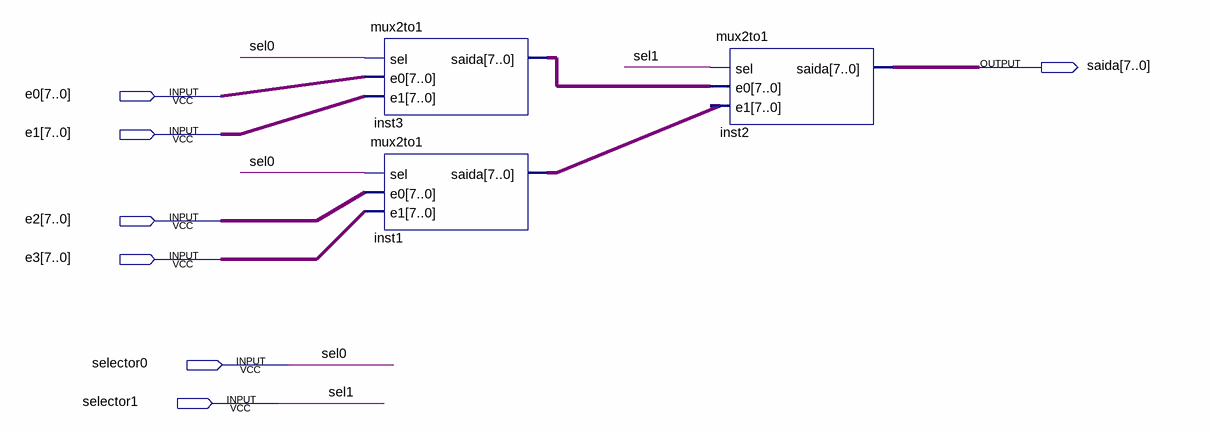
[diagram p0: schematic sheet]
// Quartus schematic mux4to1.bdf as structural Verilog: 3 symbols, 7 pins
module mux4to1 (
  input  [7:0] e0,
  input  [7:0] e1,
  input  [7:0] e2,
  input  [7:0] e3,
  input  selector0,
  input  selector1,
  output [7:0] saida
);

  wire [7:0] inst1_saida, inst3_saida;

  mux2to1 inst3 (.sel(selector0), .e0(e0), .e1(e1), .saida(inst3_saida));
  mux2to1 inst1 (.sel(selector0), .e0(e2), .e1(e3), .saida(inst1_saida));
  mux2to1 inst2 (.sel(selector1), .e0(inst3_saida), .e1(inst1_saida), .saida(saida));

  // Other names for the same wires on the sheet: sel0 = selector0; sel1 = selector1
endmodule
